# Altium schematic sheet PIC32MX_circuit.SchDoc
size A4
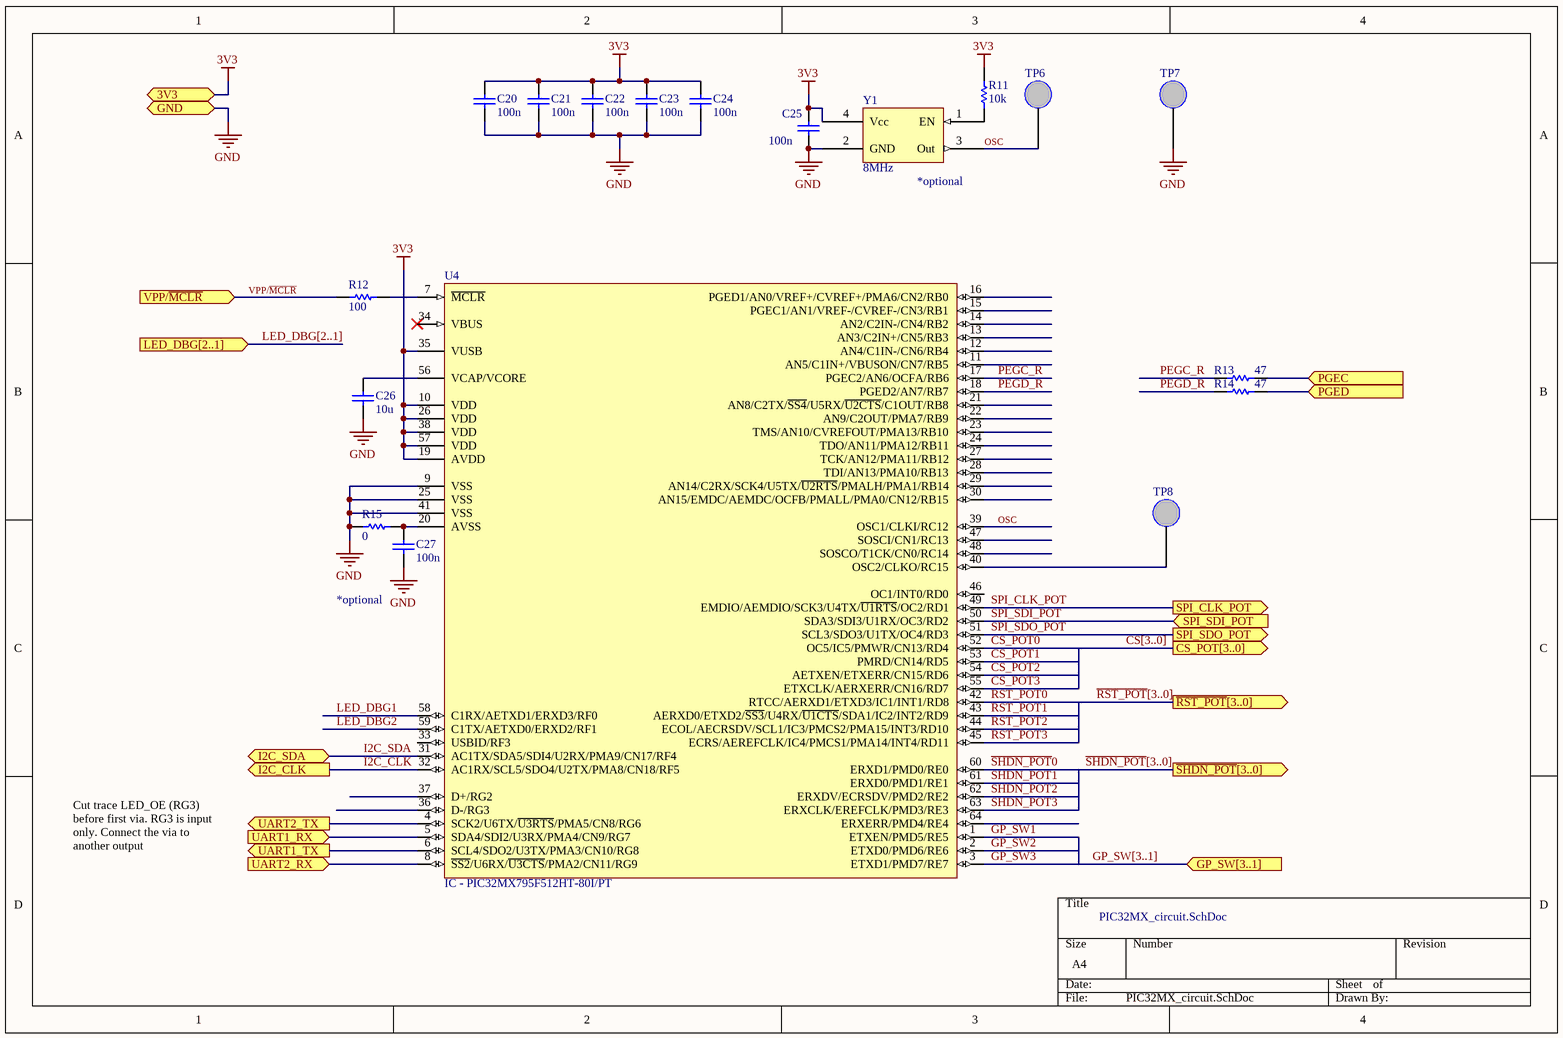
[diagram p0: PIC32MX_circuit.SchDoc]

## Parts
C20  value 100n  [CS-0603]  (hidden comment: CS - CAPACITOR)
C21  value 100n  [CS-0603]  (hidden comment: CS - CAPACITOR)
C22  value 100n  [CS-0603]  (hidden comment: CS - CAPACITOR)
C23  value 100n  [CS-0603]  (hidden comment: CS - CAPACITOR)
C24  value 100n  [CS-0603]  (hidden comment: CS - CAPACITOR)
C25  value 100n  [CS-0603]  (hidden comment: CS - CAPACITOR)
C26  value 10u  [CS-0603]  (hidden comment: CS - CAPACITOR)
C27  value 100n  [CS-0603]  (hidden comment: CS - CAPACITOR)
R11  value 10k  [RS-0603]  (hidden comment: RS - RESISTOR)
R12  value 100  [RS-0603]  (hidden comment: RS - RESISTOR)
R13  value 47  [RS-0603]  (hidden comment: RS - RESISTOR)
R14  value 47  [RS-0603]  (hidden comment: RS - RESISTOR)
R15  value 0  [RS-0603]  (hidden comment: RS - RESISTOR)
TP6  5003K  [TP - VERTICAL]  (value not drawn)
TP7  5003K  [TP - VERTICAL]  (value not drawn)
TP8  5003K  [TP - VERTICAL]  (value not drawn)
U4  IC - PIC32MX795F512HT-80I/PT  [IC-TQFP-64]
Y1  8MHz  [OSC-CB3LV]

## Ports
3V3, CS_POT[3..0] (out), GND, GP_SW[3..1] (in), I2C_CLK (out), I2C_SDA (bidir), LED_DBG[2..1] (in), PGEC (in), PGED (in), SPI_CLK_POT (out), SPI_SDI_POT (in), SPI_SDO_POT (out), UART1_RX (in), UART1_TX (out), UART2_RX (in), UART2_TX (out), VPP/~{MCLR} (in), ~{RST_POT}[3..0] (out), ~{SHDN_POT}[3..0] (out)

## Nets
3V3: C20.2 C21.2 C22.2 C23.2 C24.2 C25.2 R11.1 U4.10(VDD) U4.19(AVDD) U4.26(VDD) U4.35(VUSB) U4.38(VDD) U4.57(VDD) Y1.4(Vcc) ; port 3V3
GND: C20.1 C21.1 C22.1 C23.1 C24.1 C25.1 C26.1 C27.1 R15.2 TP7.1 U4.9(VSS) U4.25(VSS) U4.41(VSS) Y1.2(GND) ; port GND
CS_POT0: U4.52(OC5/IC5/PMWR/CN13/RD4)
CS_POT1: U4.53(PMRD/CN14/RD5)
CS_POT2: U4.54(AETXEN/ETXERR/CN15/RD6)
CS_POT3: U4.55(ETXCLK/AERXERR/CN16/RD7)
GP_SW1: U4.1(ETXEN/PMD5/RE5)
GP_SW2: U4.2(ETXD0/PMD6/RE6)
GP_SW3: U4.3(ETXD1/PMD7/RE7)
I2C_CLK: U4.32(AC1RX/SCL5/SDO4/U2TX/PMA8/CN18/RF5) ; port I2C_CLK
I2C_SDA: U4.31(AC1TX/SDA5/SDI4/U2RX/PMA9/CN17/RF4) ; port I2C_SDA
LED_DBG1: U4.58(C1RX/AETXD1/ERXD3/RF0)
LED_DBG2: U4.59(C1TX/AETXD0/ERXD2/RF1)
OSC: TP6.1 U4.39(OSC1/CLKI/RC12) Y1.3(Out)
PEGC_R: R13.1 U4.17(PGEC2/AN6/OCFA/RB6)
PEGD_R: R14.1 U4.18(PGED2/AN7/RB7)
PGEC: R13.2 ; port PGEC
PGED: R14.2 ; port PGED
~{RST_POT}0: U4.42(RTCC/AERXD1/ETXD3/IC1/INT1/RD8)
~{RST_POT}1: U4.43(AERXD0/ETXD2/~{SS3}/U4RX/~{U1CTS}/SDA1/IC2/INT2/RD9)
~{RST_POT}2: U4.44(ECOL/AECRSDV/SCL1/IC3/PMCS2/PMA15/INT3/RD10)
~{RST_POT}3: U4.45(ECRS/AEREFCLK/IC4/PMCS1/PMA14/INT4/RD11)
~{SHDN_POT}0: U4.60(ERXD1/PMD0/RE0)
~{SHDN_POT}1: U4.61(ERXD0/PMD1/RE1)
~{SHDN_POT}2: U4.62(ERXDV/ECRSDV/PMD2/RE2)
~{SHDN_POT}3: U4.63(ERXCLK/EREFCLK/PMD3/RE3)
SPI_CLK_POT: U4.49(EMDIO/AEMDIO/SCK3/U4TX/~{U1RTS}/OC2/RD1) ; port SPI_CLK_POT
SPI_SDI_POT: U4.50(SDA3/SDI3/U1RX/OC3/RD2) ; port SPI_SDI_POT
SPI_SDO_POT: U4.51(SCL3/SDO3/U1TX/OC4/RD3) ; port SPI_SDO_POT
UART1_RX: U4.5(SDA4/SDI2/U3RX/PMA4/CN9/RG7) ; port UART1_RX
UART1_TX: U4.6(SCL4/SDO2/U3TX/PMA3/CN10/RG8) ; port UART1_TX
UART2_RX: U4.8(~{SS2}/U6RX/~{U3CTS}/PMA2/CN11/RG9) ; port UART2_RX
UART2_TX: U4.4(SCK2/U6TX/~{U3RTS}/PMA5/CN8/RG6) ; port UART2_TX
VPP/~{MCLR}: R12.2 ; port VPP/~{MCLR}
NetC26_2: C26.2 U4.56(VCAP/VCORE)
NetC27_2: C27.2 R15.1 U4.20(AVSS)
NetR11_2: R11.2 Y1.1(EN)
NetR12_1: R12.1 U4.7(~{MCLR})
NetTP8_1: TP8.1 U4.40(OSC2/CLKO/RC15)

Not connected (* = marked no-connect by the designer): U4 11(AN5/C1IN+/VBUSON/CN7/RB5) 12(AN4/C1IN-/CN6/RB4) 13(AN3/C2IN+/CN5/RB3) 14(AN2/C2IN-/CN4/RB2) 15(PGEC1/AN1/VREF-/CVREF-/CN3/RB1) 16(PGED1/AN0/VREF+/CVREF+/PMA6/CN2/RB0) 21(AN8/C2TX/~{SS4}/U5RX/~{U2CTS}/C1OUT/RB8) 22(AN9/C2OUT/PMA7/RB9) 23(TMS/AN10/CVREFOUT/PMA13/RB10) 24(TDO/AN11/PMA12/RB11) 27(TCK/AN12/PMA11/RB12) 28(TDI/AN13/PMA10/RB13) 29(AN14/C2RX/SCK4/U5TX/~{U2RTS}/PMALH/PMA1/RB14) 30(AN15/EMDC/AEMDC/OCFB/PMALL/PMA0/CN12/RB15) 33(USBID/RF3) 34(VBUS)* 36(D-/RG3) 37(D+/RG2) 46(OC1/INT0/RD0) 47(SOSCI/CN1/RC13) 48(SOSCO/T1CK/CN0/RC14) 64(ERXERR/PMD4/RE4)

## Buses and harness runs
bus CS[3..0] = port CS_POT[3..0]
bus GP_SW[3..1] = port GP_SW[3..1]
bus LED_DBG[2..1] = port LED_DBG[2..1]
bus ~{RST_POT}[3..0] = port ~{RST_POT}[3..0]
bus ~{SHDN_POT}[3..0] = port ~{SHDN_POT}[3..0]

## Notes on the sheet
- (near Y1) *optional
- *optional
- Cut trace LED_OE (RG3) before first via. RG3 is input only. Connect the via to another output

## Library data of the parts
C20-C27 = CS - CAPACITOR: TOLERANCE: 10%; VOLTAGE: 16V; Supplier 1: *; Supplier Part Number 1: *; (FIELD A): *; (FLIED C): *; (FIELD B): *; Manufacturer: *
R11-R15 = RS - RESISTOR: TOLERANCE: RES TOL; POWER: RES POWER; Supplier Part Number 1: *; Supplier 1: *; (FIELD A): *; (FLIED C): *; (FIELD B): *; Manufacturer: *
TP6-TP8 = TP - Test point vertical: (FIELD A): *; (FIELD B): *; (FIELD C): *; Manufacturer: *; Supplier 1: Newark; Supplier Part Number 1: 62W5140
U4 = IC - PIC32MX795F512HT-80I/PT: Manufacturer: Microchip; Supplier 1: Digi-Key; Supplier Part Number 1: PIC32MX795F512H-80I/PT-ND; (FLIED A): *; (FLIED B): *; (FLIED C): *
Y1 = OSC - CB3LV: Oscillator; Supplier 1: Digi-Key; Supplier Part Number 1: CTX264LVCT-ND; (FLIED A): *; (FLIED B): *; (FLIED C): *; Manufacturer: *; Frequency: *